# Altium schematic sheet 04. Z-WAVE.SchDoc
size A4; DocumentNumber: 4; SheetNumber: 4; SheetTotal: 12
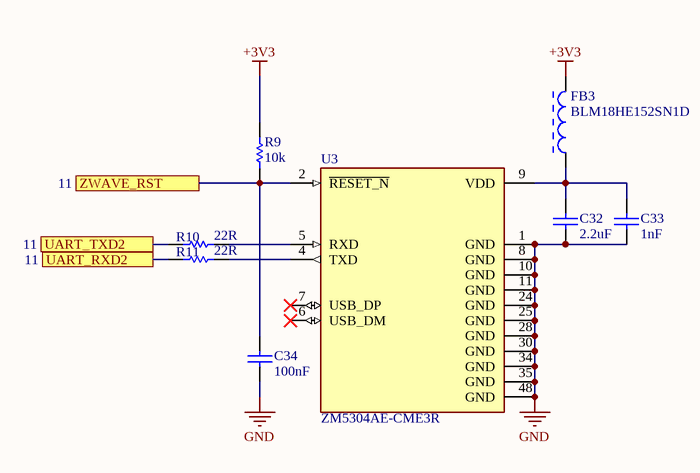
[diagram p0: 04. Z-WAVE.SchDoc]

## Parts
C32  2.2uF  [CAPC1608X90X35NL10T15]
C33  1nF  [CAPC1005X55X25NL05T10]
C34  100nF  [CAPC1005X56X25NL10T15]
FB3  BLM18HE152SN1D  [MURA-BLM18-RF-H4-CHIP-2_V]
R9  10k  [RESC1005X40X25NL05T05]
R10  22R  [RESC1005X40X25NL05T05]
R11  22R  [RESC1005X40X25NL05T05]
U3  ZM5304AE-CME3R  [ZM5304AE-CME3]

## Ports
UART_RXD2 (see 11), UART_TXD2 (see 11), ZWAVE_RST (see 11)

## Nets
+3V3: FB3.2 R9.2
GND: C32.1 C33.1 C34.1 U3.1(GND) U3.8(GND) U3.10(GND) U3.11(GND) U3.24(GND) U3.25(GND) U3.28(GND) U3.30(GND) U3.34(GND) U3.35(GND) U3.48(GND)
UART_RXD2: R11.2 ; port UART_RXD2
UART_TXD2: R10.2 ; port UART_TXD2
ZWAVE_RST: C34.2 R9.1 U3.2(~{RESET_N}) ; port ZWAVE_RST
NetC32_2: C32.2 C33.2 FB3.1 U3.9(VDD)
NetR10_1: R10.1 U3.5(RXD)
NetR11_1: R11.1 U3.4(TXD)

Not connected (* = marked no-connect by the designer): U3 6(USB_DM)* 7(USB_DP)*

## Notes on the sheet
- Title
- Size:
- Date:
- A4
- Number:
- Time:
- Revision:
- Sheet
- of
- N.S.T
- Design by:
- Check by:
- https://github.com/tung080827

## Library data of the parts
C32 = CMP-2006-02354-1: Manufacturer: Murata; Part Number: GCM188R70J225KE22D
C33 = CMP-2008-04254-1: Part Number: GRM1555C1H102JA01D; Manufacturer: Murata
C34 = CMP-2008-02743-1: Manufacturer: AVX Interconnect / Elco; Part Number: 04026D104KAT2A
FB3 = CMP-0686-00368-2: Chip Ferrite Bead for GHz Band High-speed Signal Lines, 1500 Ohm, 500 mA, -55 to 125 degC, 1.6 x 0.8 x 0.95 mm SMD, Tape and Reel; Manufacturer: Murata; Rated Current: 500 mA; Impedance (at 100 MHz): 1500 Ohm +/- 25%; DC Resistance: 0.50 Ohm Max.; Packing: Tape and Reel; DatasheetVersion: 08/2013; ComponentLink1URL: http://www.murata.com/; Mounting Technology: Surface Mount; ComponentLink2URL: http://www.murata.com/products/catalog/pdf/c31e.pdf; ComponentLink3Description: Package Specification; ComponentLink2Description: Datasheet; PackageReference: BLM18_H950-2; ComponentLink1Description: Manufacturer URL; PackageDescription: 2-Pin Chip, Body 1.6 x 0.8 mm; ComponentLink3URL: http://www.murata.com/products/catalog/pdf/c31e.pdf; PartNumber: BLM18HE152SN1D; Operating Temperature Range: -55 to 125 degC
R9-R11 = CMP-2002-08135-1: Manufacturer: Vishay Dale; Part Number: CRCW040210K0FKED
U3 = ZM5304AE-CME3R: General ISM < 1GHz Z-WaveÂ® Transceiver Module 868MHz Surface Mount; MF: Silicon Labs; SnapEDA_Link: https://www.snapeda.com/parts/ZM5304AE-CME3R/Silicon%20Labs/view-part/214706/?ref=snap; Digi-Key_Part_Number: 703-1074-1-ND; MP: ZM5304AE-CME3R; Value: *; Package: Module Sigma Designs; Digi-Key_Purchase_URL: https://www.digikey.com/product-detail/en/silicon-labs/ZM5304AE-CME3R/703-1074-1-ND/4135431?utm_source=snapeda&utm_medium=aggregator&utm_campaign=symbol